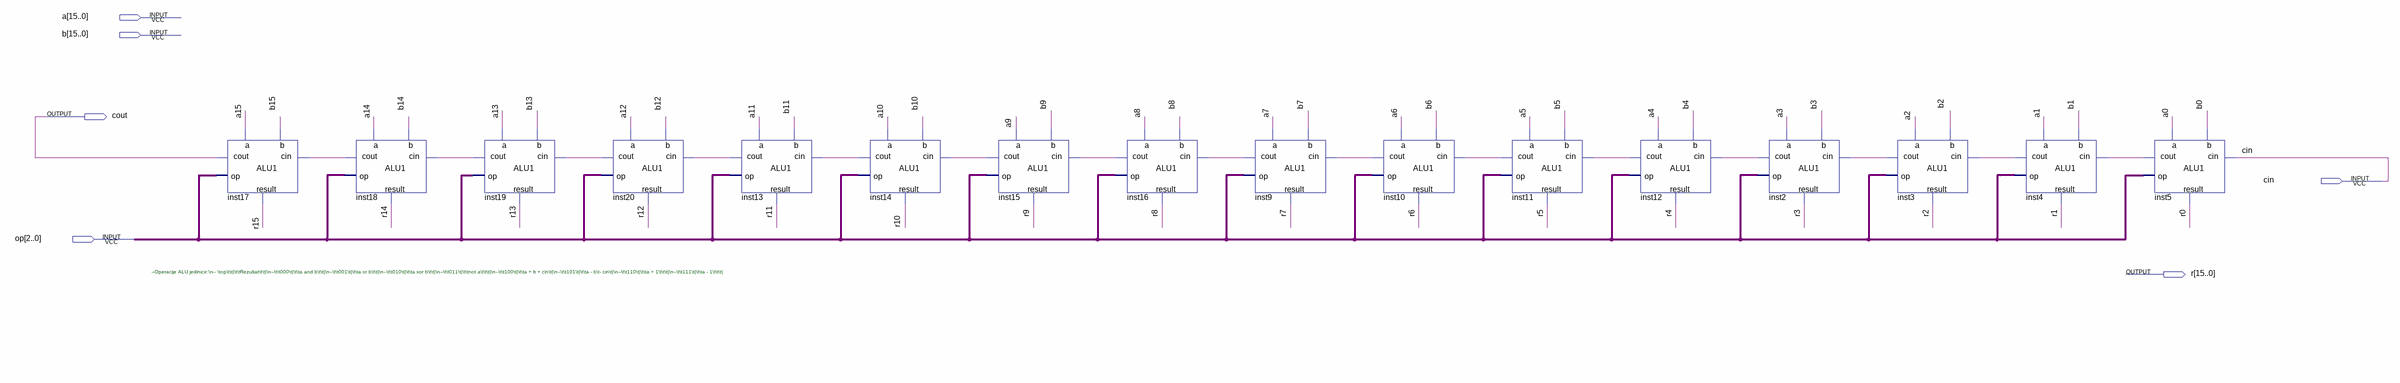
[diagram p0: schematic sheet]
// Quartus schematic ALU16.bdf as structural Verilog: 16 symbols, 6 pins
module ALU16 (
  input  [15:0] a,
  input  [15:0] b,
  input  cin,
  input  [2:0] op,
  output cout,
  output [15:0] r
);

  wire inst2_cout, inst3_cout, inst4_cout, inst5_cout, inst9_cout, inst10_cout, inst11_cout, inst12_cout,
       inst13_cout, inst14_cout, inst15_cout, inst16_cout, inst18_cout, inst19_cout, inst20_cout;

  ALU1 inst17 (.a(a[15]), .b(b[15]), .cin(inst18_cout), .op(op), .cout(cout), .result(r[15]));
  ALU1 inst18 (.a(a[14]), .b(b[14]), .cin(inst19_cout), .op(op), .cout(inst18_cout), .result(r[14]));
  ALU1 inst19 (.a(a[13]), .b(b[13]), .cin(inst20_cout), .op(op), .cout(inst19_cout), .result(r[13]));
  ALU1 inst20 (.a(a[12]), .b(b[12]), .cin(inst13_cout), .op(op), .cout(inst20_cout), .result(r[12]));
  ALU1 inst13 (.a(a[11]), .b(b[11]), .cin(inst14_cout), .op(op), .cout(inst13_cout), .result(r[11]));
  ALU1 inst14 (.a(a[10]), .b(b[10]), .cin(inst15_cout), .op(op), .cout(inst14_cout), .result(r[10]));
  ALU1 inst15 (.a(a[9]), .b(b[9]), .cin(inst16_cout), .op(op), .cout(inst15_cout), .result(r[9]));
  ALU1 inst16 (.a(a[8]), .b(b[8]), .cin(inst9_cout), .op(op), .cout(inst16_cout), .result(r[8]));
  ALU1 inst9 (.a(a[7]), .b(b[7]), .cin(inst10_cout), .op(op), .cout(inst9_cout), .result(r[7]));
  ALU1 inst10 (.a(a[6]), .b(b[6]), .cin(inst11_cout), .op(op), .cout(inst10_cout), .result(r[6]));
  ALU1 inst11 (.a(a[5]), .b(b[5]), .cin(inst12_cout), .op(op), .cout(inst11_cout), .result(r[5]));
  ALU1 inst12 (.a(a[4]), .b(b[4]), .cin(inst2_cout), .op(op), .cout(inst12_cout), .result(r[4]));
  ALU1 inst2 (.a(a[3]), .b(b[3]), .cin(inst3_cout), .op(op), .cout(inst2_cout), .result(r[3]));
  ALU1 inst3 (.a(a[2]), .b(b[2]), .cin(inst4_cout), .op(op), .cout(inst3_cout), .result(r[2]));
  ALU1 inst4 (.a(a[1]), .b(b[1]), .cin(inst5_cout), .op(op), .cout(inst4_cout), .result(r[1]));
  ALU1 inst5 (.a(a[0]), .b(b[0]), .cin(cin), .op(op), .cout(inst5_cout), .result(r[0]));

  // Notes on the sheet:
  //   --Operacije ALU jedinice:\n-- \top\t\t|\t\tRezultat\t\t|\n--\t\t000\t|\t\ta and b\t\t|\n--\t\t001\t|\t\ta or b\t\t|\n--\t\t010\t|\t\ta xor b\t\t|\n--\t\t011\t|\t\tnot a\t\t\t|\n--\t\t100\t|\t\ta + b + cin\t|\n--\t\t101\t|\t\ta - b\t- cin\t|\n--\t\t110\t|\t\ta + 1\t\t\t|\n--\t\t111\t|\t\ta - 1\t\t\t|
endmodule
